# Altium schematic sheet Main_logiv.SchDoc
size 420 x 297 mm; SheetNumber: 1; SheetTotal: 2
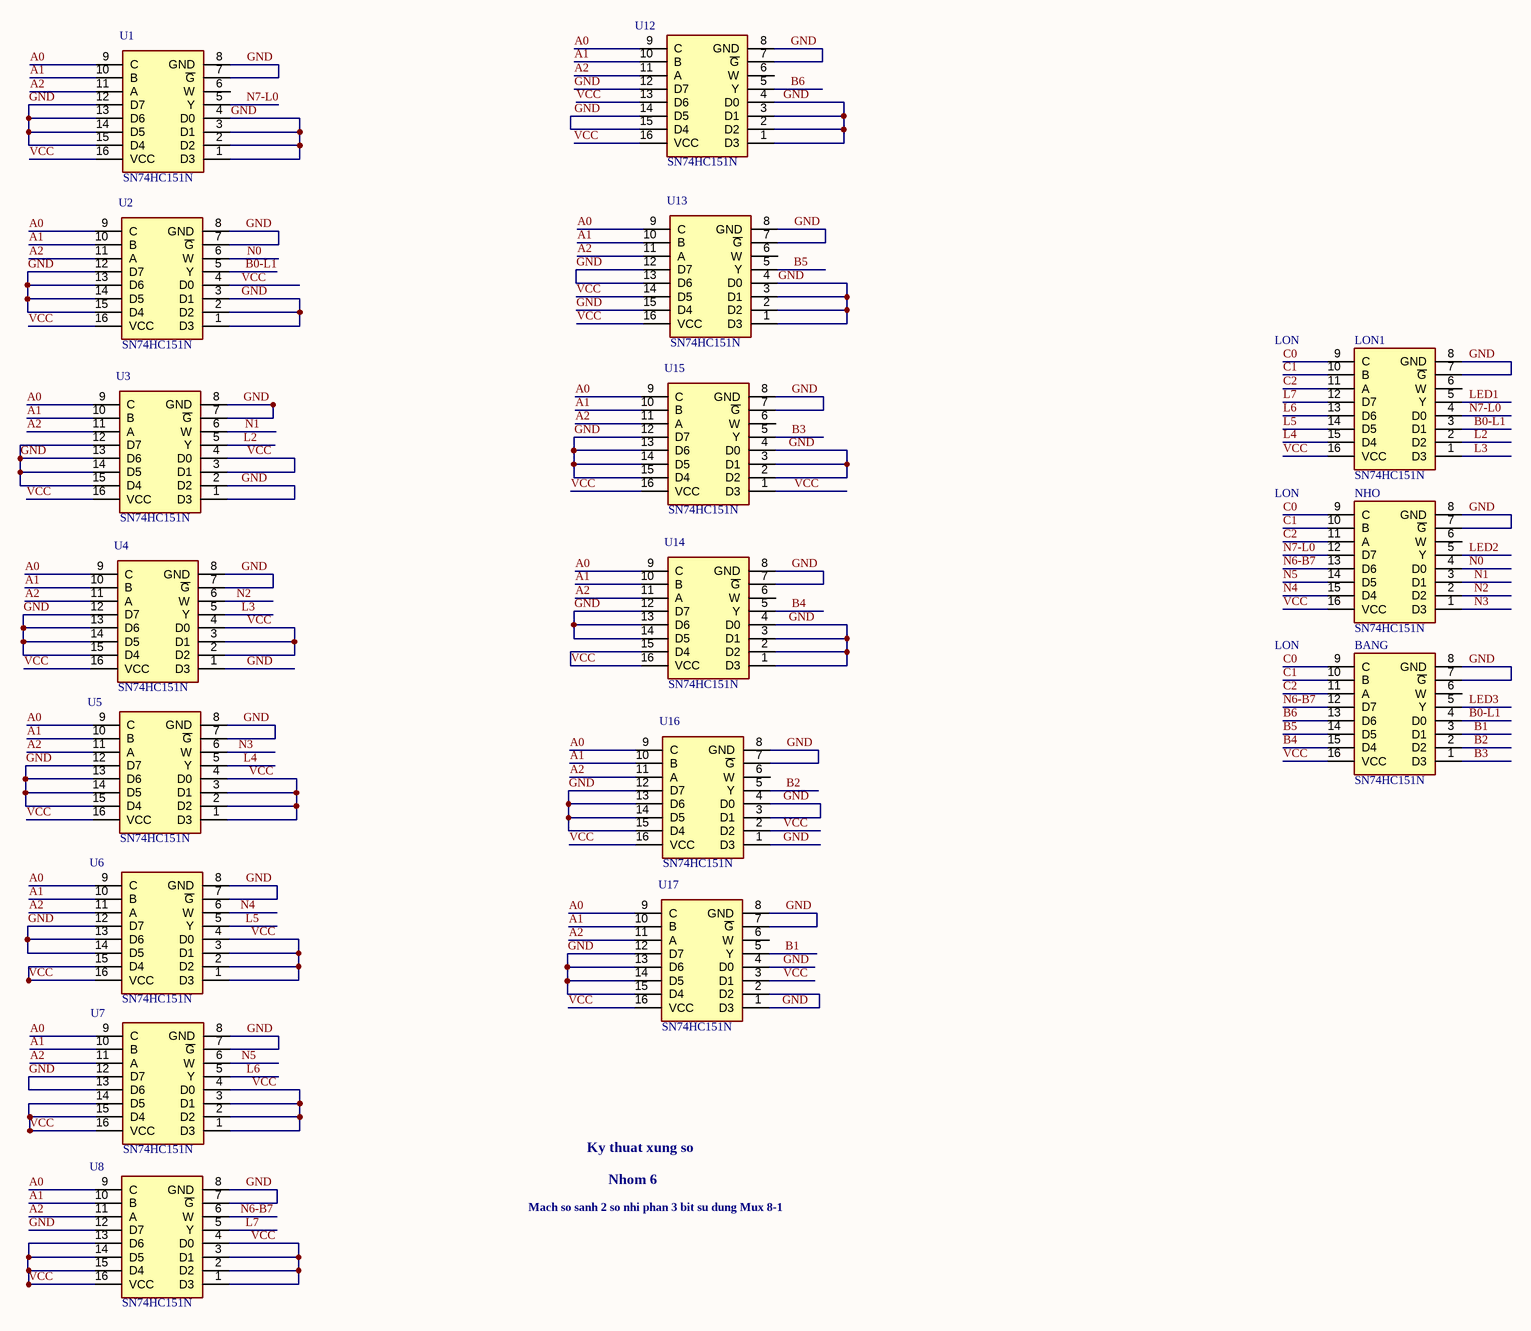
[diagram p0: Main_logiv.SchDoc]

## Parts
BANG  SN74HC151N  [DIP794W53P254L1930H508Q16N]
LON1  SN74HC151N  [DIP794W53P254L1930H508Q16N]
NHO  SN74HC151N  [DIP794W53P254L1930H508Q16N]
U1  SN74HC151N  [DIP794W53P254L1930H508Q16N]
U2  SN74HC151N  [DIP794W53P254L1930H508Q16N]
U3  SN74HC151N  [DIP794W53P254L1930H508Q16N]
U4  SN74HC151N  [DIP794W53P254L1930H508Q16N]
U5  SN74HC151N  [DIP794W53P254L1930H508Q16N]
U6  SN74HC151N  [DIP794W53P254L1930H508Q16N]
U7  SN74HC151N  [DIP794W53P254L1930H508Q16N]
U8  SN74HC151N  [DIP794W53P254L1930H508Q16N]
U12  SN74HC151N  [DIP794W53P254L1930H508Q16N]
U13  SN74HC151N  [DIP794W53P254L1930H508Q16N]
U14  SN74HC151N  [DIP794W53P254L1930H508Q16N]
U15  SN74HC151N  [DIP794W53P254L1930H508Q16N]
U16  SN74HC151N  [DIP794W53P254L1930H508Q16N]
U17  SN74HC151N  [DIP794W53P254L1930H508Q16N]

## Nets
A0: U1.9(C) U2.9(C) U3.9(C) U4.9(C) U5.9(C) U6.9(C) U7.9(C) U8.9(C) U12.9(C) U13.9(C) U14.9(C) U15.9(C) U16.9(C) U17.9(C)
A1: U1.10(B) U2.10(B) U3.10(B) U4.10(B) U5.10(B) U6.10(B) U7.10(B) U8.10(B) U12.10(B) U13.10(B) U14.10(B) U15.10(B) U16.10(B) U17.10(B)
A2: U1.11(A) U2.11(A) U3.11(A) U4.11(A) U5.11(A) U6.11(A) U7.11(A) U8.11(A) U12.11(A) U13.11(A) U14.11(A) U15.11(A) U16.11(A) U17.11(A)
B0-L1: BANG.4(D0) LON1.3(D1) U2.5(Y)
B1: BANG.3(D1) U17.5(Y)
B2: BANG.2(D2) U16.5(Y)
B3: BANG.1(D3) U15.5(Y)
B4: BANG.15(D4) U14.5(Y)
B5: BANG.14(D5) U13.5(Y)
B6: BANG.13(D6) U12.5(Y)
C0: BANG.9(C) LON1.9(C) NHO.9(C)
C1: BANG.10(B) LON1.10(B) NHO.10(B)
C2: BANG.11(A) LON1.11(A) NHO.11(A)
GND: BANG.7(~{G}) BANG.8(GND) LON1.7(~{G}) LON1.8(GND) NHO.7(~{G}) NHO.8(GND) U1.1(D3) U1.2(D2) U1.3(D1) U1.4(D0) U1.7(~{G}) U1.8(GND) U1.12(D7) U1.13(D6) U1.14(D5) U1.15(D4) U2.1(D3) U2.2(D2) U2.3(D1) U2.7(~{G}) U2.8(GND) U2.12(D7) U2.13(D6) U2.14(D5) U2.15(D4) U3.1(D3) U3.2(D2) U3.7(~{G}) U3.8(GND) U3.12(D7) U3.13(D6) U3.14(D5) U3.15(D4) U4.1(D3) U4.7(~{G}) U4.8(GND) U4.12(D7) U4.13(D6) U4.14(D5) U4.15(D4) U5.7(~{G}) U5.8(GND) U5.12(D7) U5.13(D6) U5.14(D5) U5.15(D4) U6.7(~{G}) U6.8(GND) U6.12(D7) U6.13(D6) U6.14(D5) U7.7(~{G}) U7.8(GND) U7.12(D7) U7.13(D6) U8.7(~{G}) U8.8(GND) U8.12(D7) U12.1(D3) U12.2(D2) U12.3(D1) U12.4(D0) U12.7(~{G}) U12.8(GND) U12.12(D7) U12.14(D5) U12.15(D4) U13.1(D3) U13.2(D2) U13.3(D1) U13.4(D0) U13.7(~{G}) U13.8(GND) U13.12(D7) U13.13(D6) U13.15(D4) U14.1(D3) U14.2(D2) U14.3(D1) U14.4(D0) U14.7(~{G}) U14.8(GND) U14.12(D7) U14.13(D6) U14.14(D5) U15.2(D2) U15.3(D1) U15.4(D0) U15.7(~{G}) U15.8(GND) U15.12(D7) U15.13(D6) U15.14(D5) U15.15(D4) U16.1(D3) U16.3(D1) U16.4(D0) U16.7(~{G}) U16.8(GND) U16.12(D7) U16.13(D6) U16.14(D5) U16.15(D4) U17.1(D3) U17.2(D2) U17.4(D0) U17.7(~{G}) U17.8(GND) U17.12(D7) U17.13(D6) U17.14(D5) U17.15(D4)
L2: LON1.2(D2) U3.5(Y)
L3: LON1.1(D3) U4.5(Y)
L4: LON1.15(D4) U5.5(Y)
L5: LON1.14(D5) U6.5(Y)
L6: LON1.13(D6) U7.5(Y)
L7: LON1.12(D7) U8.5(Y)
LED1: LON1.5(Y)
LED2: NHO.5(Y)
LED3: BANG.5(Y)
N0: NHO.4(D0) U2.6(W)
N1: NHO.3(D1) U3.6(W)
N2: NHO.2(D2) U4.6(W)
N3: NHO.1(D3) U5.6(W)
N4: NHO.15(D4) U6.6(W)
N5: NHO.14(D5) U7.6(W)
N6-B7: BANG.12(D7) NHO.13(D6) U8.6(W)
N7-L0: LON1.4(D0) NHO.12(D7) U1.5(Y)
VCC: BANG.16(VCC) LON1.16(VCC) NHO.16(VCC) U1.16(VCC) U2.4(D0) U2.16(VCC) U3.3(D1) U3.4(D0) U3.16(VCC) U4.2(D2) U4.3(D1) U4.4(D0) U4.16(VCC) U5.1(D3) U5.2(D2) U5.3(D1) U5.4(D0) U5.16(VCC) U6.1(D3) U6.2(D2) U6.3(D1) U6.4(D0) U6.15(D4) U6.16(VCC) U7.1(D3) U7.2(D2) U7.3(D1) U7.4(D0) U7.14(D5) U7.15(D4) U7.16(VCC) U8.1(D3) U8.2(D2) U8.3(D1) U8.4(D0) U8.13(D6) U8.14(D5) U8.15(D4) U8.16(VCC) U12.13(D6) U12.16(VCC) U13.14(D5) U13.16(VCC) U14.15(D4) U14.16(VCC) U15.1(D3) U15.16(VCC) U16.2(D2) U16.16(VCC) U17.3(D1) U17.16(VCC)

Not connected (* = marked no-connect by the designer): BANG 6(W); LON1 6(W); NHO 6(W); U1 6(W); U12 6(W); U13 6(W); U14 6(W); U15 6(W); U16 6(W); U17 6(W)

## Notes on the sheet
- LON
- Ky thuat xung so
- Nhom 6
- Mach so sanh 2 so nhi phan 3 bit su dung Mux 8-1
- THIS DOCUMENT AND THE DATA DISCLOSED HEREIN OR
- HEREWITH IS THE PROPERTY OF ALTIUM LIMITED AND MAY
- DWG NO:
- REVISION
- REV:
- DESCRIPTION
- DATE
- APPROVED
- BE FREELY DISTRIBUTED IN WHOLE. NO RIGHTS ARE
- RESERVED OR EXPRESS OR IMPLIED WARANTEE GIVEN.
- ENG:
- APPROVALS
- PROJECT
- DSN:
- CHK:
- REFERENCE DOCUMENTS
- PROJECT REVISION:
- TITLE
- DOCUMENT REVISION:
- DESIGN ITEM:
- BOM:
- FAB DWG:
- PCB DWG:
- ASSY DWG:
- SCALE:
- A3
- SIZE
- CAGE CODE
- FILE NAME
- DWG NO.
- SHEET
- OF
- REV

## Library data of the parts
BANG LON1 NHO U1-U8 U12-U17 = SN74HC151N: Integrated Circuit; Manufacturer_Name: Texas Instruments; Datasheet Link: https://www.ti.com/lit/gpn/SN74HC151; Height: 5.08mm; Manufacturer_Part_Number: SN74HC151N; Mouser Part Number: 595-SN74HC151N; Mouser Price/Stock: https://www.mouser.co.uk/ProductDetail/Texas-Instruments/SN74HC151N?qs=st7IWvlL5%2FgZ0EYsqHF4AQ%3D%3D